# Altium project Faydali_Yuk_Project.PrjPcb
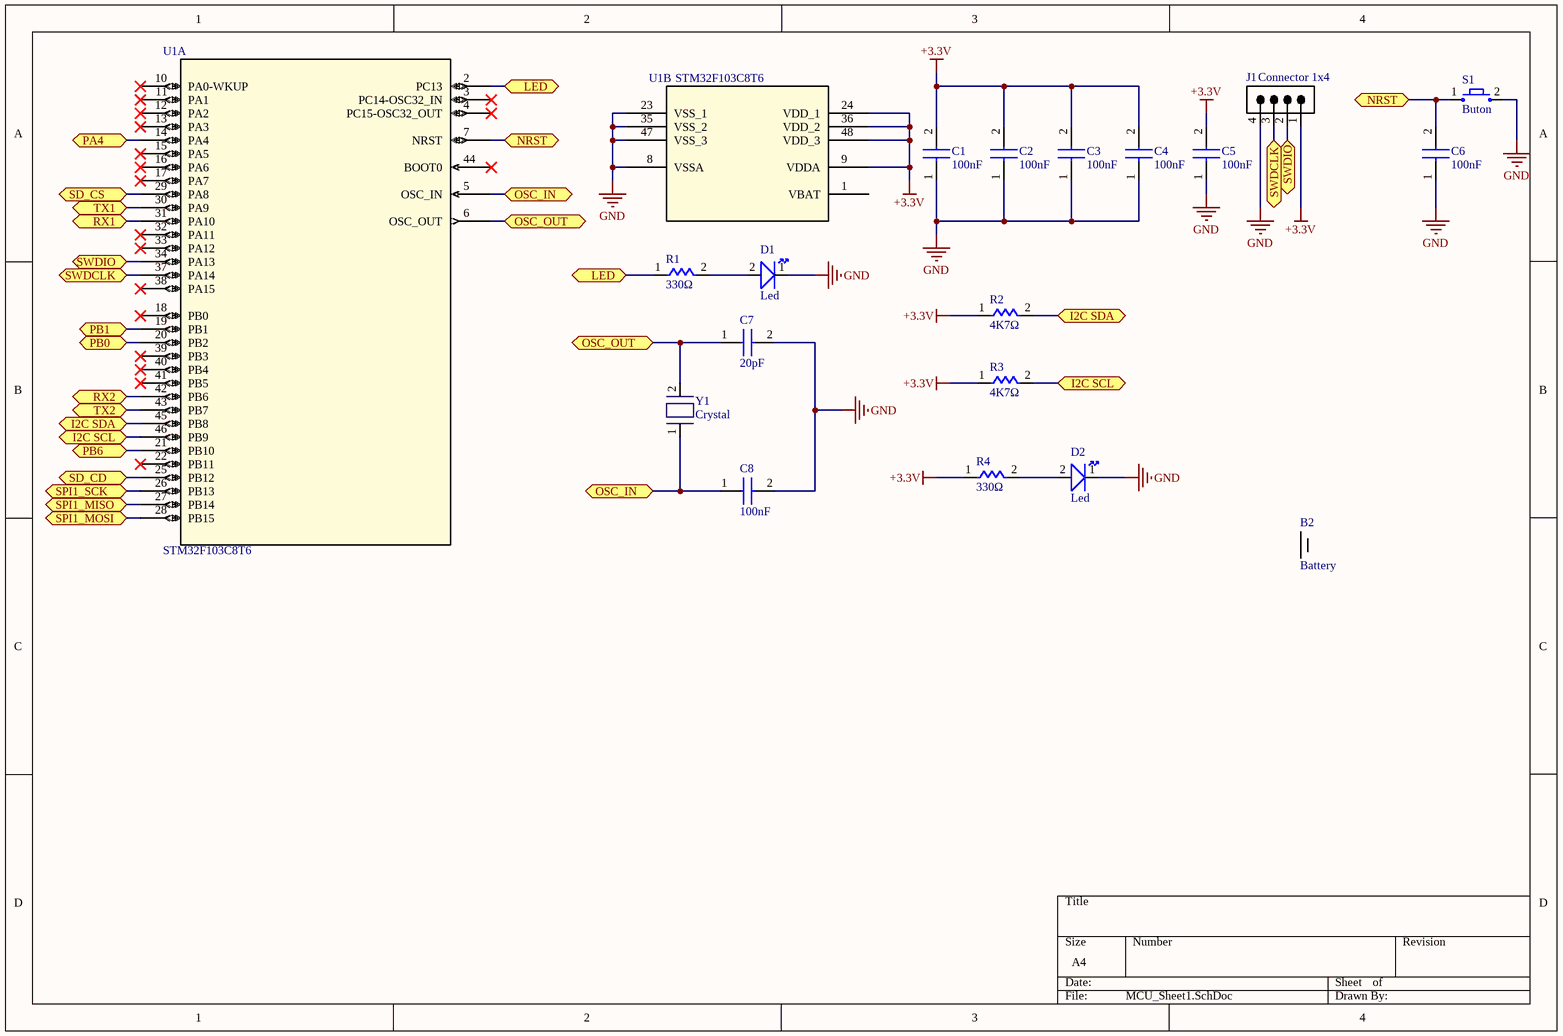
[diagram p0: MCU_Sheet1.SchDoc]
11 sheets, 73 parts. Net scope: flat (ports and power ports of the same name join across sheets).
Board file: PCB2.PcbDoc
Sheets:
  MCU_Sheet1.SchDoc
  SD_CARD_Sheet1.SchDoc
  BME_280_Sheet1.SchDoc
  MPU_6050_Sheet1.SchDoc
  LORA_Sheet1.SchDoc
  GY_NEO6MV2_Sheet1.SchDoc
  AMS_Sheet1.SchDoc
  LM2596_Sheet1.SchDoc
  OPEN_DRAIN_Sheet1.SchDoc
  Buzzer.SchDoc
  MQ-135.SchDoc

## Sheet MCU_Sheet1.SchDoc
size A4; SheetNumber: 1; SheetTotal: 11

### Parts
B2  Battery  [Lityum Battery]
C1  100nF  [CAP - 0603]
C2  100nF  [CAP - 0603]
C3  100nF  [CAP - 0603]
C4  100nF  [CAP - 0603]
C5  100nF  [CAP - 0603]
C6  100nF  [CAP - 0603]
C7  20pF  [CAP - 0603]
C8  100nF  [CAP - 0603]
D1  Led  [LED - 0603]
D2  Led  [LED - 0603]
J1  Connector 1x4  [Connector 1x4]
R1  330Ω  [RES - 0603]
R2  4K7Ω  [RES - 0603]
R3  4K7Ω  [RES - 0603]
R4  330Ω  [RES - 0603]
S1  Buton  [Button - DTSMF31RVTR]
U1  STM32F103C8T6  [LQFP48]  (parts A,B of 2)
Y1  Crystal  [Crystal - HC-49S SMD]

### Ports
I2C SCL (bidir), I2C SDA (bidir), LED (bidir), NRST (bidir), OSC_IN (bidir), OSC_OUT (bidir), PA4 (bidir), PB0 (bidir), PB1 (bidir), PB6 (bidir), RX1 (bidir), RX2 (bidir), SD_CD (bidir), SD_CS (bidir), SPI1_MISO (bidir), SPI1_MOSI (bidir), SPI1_SCK (bidir), SWDCLK (bidir), SWDIO (bidir), TX1 (bidir), TX2 (bidir)

### Nets
+3.3V: C1.2 C2.2 C3.2 C4.2 C5.2 J1.1 R2.1 R3.1 R4.1 U1.9(VDDA) U1.24(VDD_1) U1.36(VDD_2) U1.48(VDD_3)
GND: C1.1 C2.1 C3.1 C4.1 C5.1 C6.1 C7.2 C8.2 D1.1 D2.1 J1.4 S1.2 U1.8(VSSA) U1.23(VSS_1) U1.35(VSS_2) U1.47(VSS_3)
NetC6_2: C6.2 S1.1 U1.7(NRST) ; port NRST
NetC7_1: C7.1 U1.6(OSC_OUT) Y1.2 ; port OSC_OUT
NetC8_1: C8.1 U1.5(OSC_IN) Y1.1 ; port OSC_IN
NetD1_2: D1.2 R1.2
NetD2_2: D2.2 R4.2
NetJ1_2: J1.2 U1.34(PA13) ; port SWDIO
NetJ1_3: J1.3 U1.37(PA14) ; port SWDCLK
NetJ2_2: U1.29(PA8) ; port SD_CS
NetJ2_3: U1.28(PB15) ; port SPI1_MOSI
NetJ2_5: U1.26(PB13) ; port SPI1_SCK
NetJ2_7: U1.27(PB14) ; port SPI1_MISO
NetJ2_9: U1.25(PB12) ; port SD_CD
NetL2_3: U1.21(PB10) ; port PB6
NetR1_1: R1.1 U1.2(PC13) ; port LED
NetR2_2: R2.2 U1.45(PB8) ; port I2C SDA
NetR3_2: R3.2 U1.46(PB9) ; port I2C SCL
NetR10_1: U1.19(PB1) ; port PB1
NetR11_1: U1.20(PB2) ; port PB0
NetR15_1: U1.14(PA4) ; port PA4
NetR19_2: U1.42(PB6) ; port RX2
NetR20_2: U1.43(PB7) ; port TX2
NetU1_30: U1.30(PA9) ; port TX1
NetU1_31: U1.31(PA10) ; port RX1

Not connected (* = marked no-connect by the designer): U1 1(VBAT) 3(PC14-OSC32_IN)* 4(PC15-OSC32_OUT)* 10(PA0-WKUP)* 11(PA1)* 12(PA2)* 13(PA3)* 15(PA5)* 16(PA6)* 17(PA7)* 18(PB0)* 22(PB11)* 32(PA11)* 33(PA12)* 38(PA15)* 39(PB3)* 40(PB4)* 41(PB5)* 44(BOOT0)*

### Library data of the parts
C1-C8 = CAP: Capacitor; ComponentLink1Description: Satın Alma Linki; ComponentLink1URL: https://ozdisan.com/pasif-komponentler/kondansatorler/smt-smd-ve-mlcc-kondansatorler/CL10B472KB8NNNC; ComponentLink2Description: Satın Alma Linki; ComponentLink2URL: https://ozdisan.com/pasif-komponentler/kondansatorler/smt-smd-ve-mlcc-kondansatorler/CL10C200JB8NNNC; ComponentLink3Description: Satın Alma Linki; ComponentLink3URL: https://ozdisan.com/pasif-komponentler/kondansatorler/smt-smd-ve-mlcc-kondansatorler/CL10B104KB8NNNC; ComponentLink4Description: Datasheet; ComponentLink4URL: https://cdn.ozdisan.com/ETicaret_Dosya/448212_5798276.PDF; ComponentLink5Description: Satın Alma Linki; ComponentLink5URL: https://ozdisan.com/pasif-komponentler/kondansatorler/smt-smd-ve-mlcc-kondansatorler/CL10C101JB8NNNC
D1 D2 = Led: HL-PST-1608U51GC - LED SMD 0603 GREEN 500mcd 120° WATER CLEAR; ComponentLink1Description: Satın Alma Linki; ComponentLink1URL: https://ozdisan.com/Product/Detail/471660/HL-PST-1608U51GC; ComponentLink2Description: Datasheet; ComponentLink2URL: https://cdn.ozdisan.com/ETicaret_Dosya/471660_7204356.pdf
J1 = Connector 1x4: MOLEX-705530003 - CONNECTOR HEADER 2.54MM 4P 90C GOLD; ComponentLink1Description: Datasheet; ComponentLink1URL: https://www.molex.com/pdm_docs/sd/705530003_sd.pdf; ComponentLink2Description: Satın Alma Linki; ComponentLink2URL: https://www.ozdisan.com/konnektor-ve-baglanti-elemanlari/konnektor-cesitleri/pcb-konnektorler/MOLEX-705530003
R1-R4 = Res: SMD Res; ComponentLink1Description: Datasheet; ComponentLink1URL: https://cdn.ozdisan.com/ETicaret_Dosya/570122_9878629.pdf; ComponentLink2Description: Satın Alma Linki; ComponentLink2URL: https://www.ozdisan.com/pasif-komponentler/direncler/smt-smd-direncler/TC0325B3301T5C; ComponentLink3Description: Satın Alma Linki; ComponentLink3URL: https://ozdisan.com/pasif-komponentler/direncler/smt-smd-ve-cip-direncler/0603SAF4701T5E; ComponentLink4Description: Satın Alma Linki; ComponentLink4URL: https://ozdisan.com/pasif-komponentler/direncler/smt-smd-ve-cip-direncler/0805S8F604JT5E; ComponentLink5Description: Satın Alma Linki; ComponentLink5URL: https://ozdisan.com/pasif-komponentler/direncler/smt-smd-ve-cip-direncler/0603SAF1022T5E; ComponentLink6Description: Satın Alma Linki; ComponentLink6URL: https://www.ozdisan.com/pasif-komponentler/direncler/smt-smd-direncler/CQ03SAF0000T5E
S1 = Buton: DTSMF-31R-V-T/R - SWITCH TACT 6.00x3.50 4.30mm 260gF SMT V/T; ComponentLink1Description: Satın Alma Linki; ComponentLink1URL: https://ozdisan.com/Product/Detail/354235/DTSMF-31R-V-TR; ComponentLink2Description: Datasheet; ComponentLink2URL: https://cdn.ozdisan.com/ETicaret_Dosya/485632_396522.pdf
U1 = STM32F103C8T6: Microcontroller; Mfr_Name: STMicroelectronics; Copyright: Copyright (C) 2021 Ultra Librarian. All rights reserved.; Manufacturer_Part_Number: STM32F103C8T6; RefDes: RefDes; Type: DEV
Y1 = Crystal: AS-8.000-18-SMD-TR - CRYSTAL 8.0000MHZ 18PF SMD; ComponentLink1Description: Satın Alma Linki; ComponentLink1URL: https://ozdisan.com/pasif-komponentler/kristaller-osilatorler-ve-rezanatorler/kristaller/AS-8-000-18-SMD-TR; ComponentLink2Description: Datasheet; ComponentLink2URL: https://cdn.ozdisan.com/ETicaret_Dosya/40505_2732396.pdf
B2 = Battery: ComponentLink1Description: Satın Alma Linki; ComponentLink1URL: https://www.gittigidiyor.com/bilgisayar-tablet/12v-2-6a-lityum-batarya_pdp_728518934

## Sheet SD_CARD_Sheet1.SchDoc
size A4; SheetNumber: 2; SheetTotal: 11
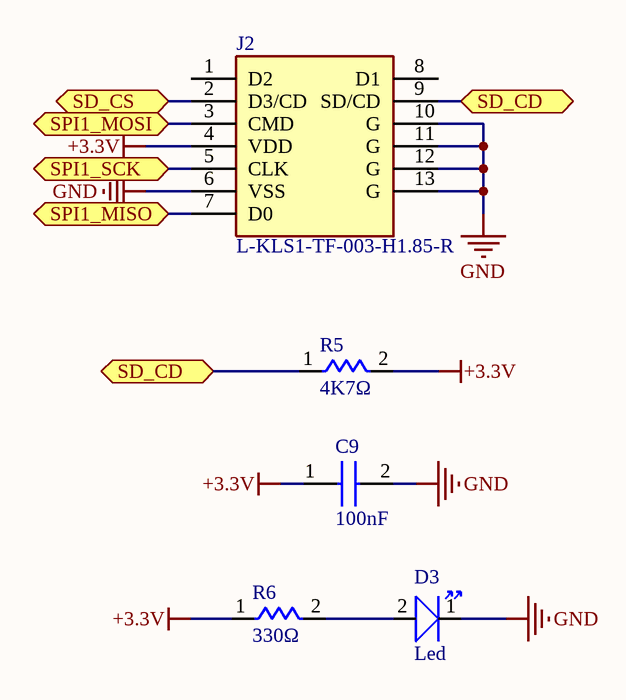
[diagram p1: SD_CARD_Sheet1.SchDoc]

### Parts
C9  100nF  [CAP - 0603]
D3  Led  [LED - 0603]
J2  L-KLS1-TF-003-H1.85-R  [SD CARD L-KLS1-TF-003-H1.85-R]
R5  4K7Ω  [RES - 0603]
R6  330Ω  [RES - 0603]

### Ports
SD_CD (bidir), SD_CS (bidir), SPI1_MISO (bidir), SPI1_MOSI (bidir), SPI1_SCK (bidir)

### Nets
+3.3V: C9.1 J2.4(VDD) R5.2 R6.1
GND: C9.2 D3.1 J2.6(VSS) J2.10(G) J2.11(G) J2.12(G) J2.13(G)
NetD3_2: D3.2 R6.2
NetJ2_2: J2.2(D3/CD) ; port SD_CS
NetJ2_3: J2.3(CMD) ; port SPI1_MOSI
NetJ2_5: J2.5(CLK) ; port SPI1_SCK
NetJ2_7: J2.7(D0) ; port SPI1_MISO
NetJ2_9: J2.9(SD/CD) R5.1 ; port SD_CD

Not connected (* = marked no-connect by the designer): J2 1(D2) 8(D1)

### Library data of the parts
C9 = CAP: Capacitor; ComponentLink1Description: Satın Alma Linki; ComponentLink1URL: https://ozdisan.com/pasif-komponentler/kondansatorler/smt-smd-ve-mlcc-kondansatorler/CL10B472KB8NNNC; ComponentLink2Description: Satın Alma Linki; ComponentLink2URL: https://ozdisan.com/pasif-komponentler/kondansatorler/smt-smd-ve-mlcc-kondansatorler/CL10C200JB8NNNC; ComponentLink3Description: Satın Alma Linki; ComponentLink3URL: https://ozdisan.com/pasif-komponentler/kondansatorler/smt-smd-ve-mlcc-kondansatorler/CL10B104KB8NNNC; ComponentLink4Description: Datasheet; ComponentLink4URL: https://cdn.ozdisan.com/ETicaret_Dosya/448212_5798276.PDF; ComponentLink5Description: Satın Alma Linki; ComponentLink5URL: https://ozdisan.com/pasif-komponentler/kondansatorler/smt-smd-ve-mlcc-kondansatorler/CL10C101JB8NNNC
D3 = Led: as D1 on sheet MCU_Sheet1; ComponentLink1Description: Satın Alma Linki; ComponentLink1URL: https://ozdisan.com/Product/Detail/471660/HL-PST-1608U51GC; ComponentLink2Description: Datasheet; ComponentLink2URL: https://cdn.ozdisan.com/ETicaret_Dosya/471660_7204356.pdf
J2 = SD CARD L-KLS1-TF-003-H1.85-R: L-KLS1-TF-003-H1.85-R - CONNECTOR MICRO SD CARD SMD KLS; Manufacturer_Name: KLS Electronic; Datasheet Link: https://img.ozdisan.com/ETicaret_Dosya/476392_7149645.pdf; Manufacturer_Part_Number: L-KLS1-TF-003-H1.85-R; ComponentLink1Description: Satın Alma Linki; ComponentLink1URL: https://ozdisan.com/Product/Detail/466548/L-KLS1-TF-003-H1-85-R; ComponentLink2Description: Datasheet; ComponentLink2URL: https://cdn.ozdisan.com/ETicaret_Dosya/466548_2616024.PDF
R5 R6 = Res: SMD Res; ComponentLink1Description: Datasheet; ComponentLink1URL: https://cdn.ozdisan.com/ETicaret_Dosya/570122_9878629.pdf; ComponentLink2Description: Satın Alma Linki; ComponentLink2URL: https://www.ozdisan.com/pasif-komponentler/direncler/smt-smd-direncler/TC0325B3301T5C; ComponentLink3Description: Satın Alma Linki; ComponentLink3URL: https://ozdisan.com/pasif-komponentler/direncler/smt-smd-ve-cip-direncler/0603SAF4701T5E; ComponentLink4Description: Satın Alma Linki; ComponentLink4URL: https://ozdisan.com/pasif-komponentler/direncler/smt-smd-ve-cip-direncler/0805S8F604JT5E; ComponentLink5Description: Satın Alma Linki; ComponentLink5URL: https://ozdisan.com/pasif-komponentler/direncler/smt-smd-ve-cip-direncler/0603SAF1022T5E; ComponentLink6Description: Satın Alma Linki; ComponentLink6URL: https://www.ozdisan.com/pasif-komponentler/direncler/smt-smd-direncler/CQ03SAF0000T5E

## Sheet BME_280_Sheet1.SchDoc
size A4; SheetNumber: 3; SheetTotal: 11
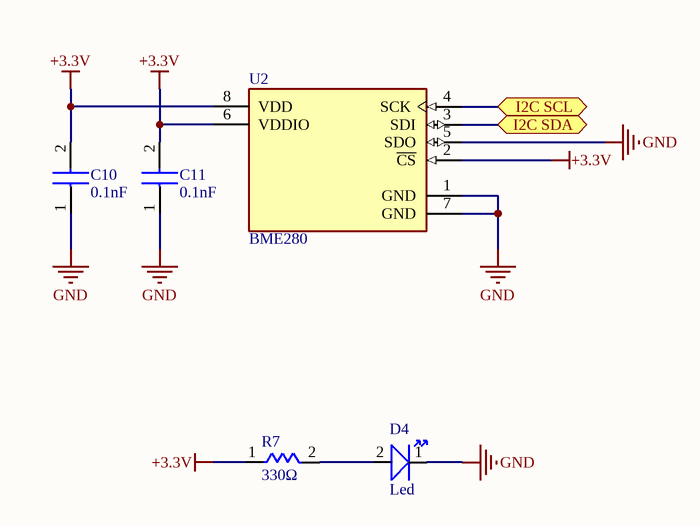
[diagram p2: BME_280_Sheet1.SchDoc]

### Parts
C10  0.1nF  [CAP - 0603]
C11  0.1nF  [CAP - 0603]
D4  Led  [LED - 0603]
R7  330Ω  [RES - 0603]
U2  BME280  [BME280 - FP-BME280-MFG]

### Ports
I2C SCL (bidir), I2C SDA (bidir)

### Nets
+3.3V: C10.2 C11.2 R7.1 U2.2(~{CS}) U2.6(VDDIO) U2.8(VDD)
GND: C10.1 C11.1 D4.1 U2.1(GND) U2.5(SDO) U2.7(GND)
NetD4_2: D4.2 R7.2
NetR2_2: U2.3(SDI) ; port I2C SDA
NetR3_2: U2.4(SCK) ; port I2C SCL

### Library data of the parts
C10 C11 = CAP: Capacitor; ComponentLink1Description: Satın Alma Linki; ComponentLink1URL: https://ozdisan.com/pasif-komponentler/kondansatorler/smt-smd-ve-mlcc-kondansatorler/CL10B472KB8NNNC; ComponentLink2Description: Satın Alma Linki; ComponentLink2URL: https://ozdisan.com/pasif-komponentler/kondansatorler/smt-smd-ve-mlcc-kondansatorler/CL10C200JB8NNNC; ComponentLink3Description: Satın Alma Linki; ComponentLink3URL: https://ozdisan.com/pasif-komponentler/kondansatorler/smt-smd-ve-mlcc-kondansatorler/CL10B104KB8NNNC; ComponentLink4Description: Datasheet; ComponentLink4URL: https://cdn.ozdisan.com/ETicaret_Dosya/448212_5798276.PDF; ComponentLink5Description: Satın Alma Linki; ComponentLink5URL: https://ozdisan.com/pasif-komponentler/kondansatorler/smt-smd-ve-mlcc-kondansatorler/CL10C101JB8NNNC
D4 = Led: as D1 on sheet MCU_Sheet1; ComponentLink1Description: Satın Alma Linki; ComponentLink1URL: https://ozdisan.com/Product/Detail/471660/HL-PST-1608U51GC; ComponentLink2Description: Datasheet; ComponentLink2URL: https://cdn.ozdisan.com/ETicaret_Dosya/471660_7204356.pdf
R7 = Res: SMD Res; ComponentLink1Description: Datasheet; ComponentLink1URL: https://cdn.ozdisan.com/ETicaret_Dosya/570122_9878629.pdf; ComponentLink2Description: Satın Alma Linki; ComponentLink2URL: https://www.ozdisan.com/pasif-komponentler/direncler/smt-smd-direncler/TC0325B3301T5C; ComponentLink3Description: Satın Alma Linki; ComponentLink3URL: https://ozdisan.com/pasif-komponentler/direncler/smt-smd-ve-cip-direncler/0603SAF4701T5E; ComponentLink4Description: Satın Alma Linki; ComponentLink4URL: https://ozdisan.com/pasif-komponentler/direncler/smt-smd-ve-cip-direncler/0805S8F604JT5E; ComponentLink5Description: Satın Alma Linki; ComponentLink5URL: https://ozdisan.com/pasif-komponentler/direncler/smt-smd-ve-cip-direncler/0603SAF1022T5E; ComponentLink6Description: Satın Alma Linki; ComponentLink6URL: https://www.ozdisan.com/pasif-komponentler/direncler/smt-smd-direncler/CQ03SAF0000T5E
U2 = BME 280- CMP-2000-05073-3: SENSOR PRESSURE HUMIDITY TEMP; Sensor Type: Temperature; Accuracy: 3%; Response Time: 1s; Output Type: SPI; Min Operating Temperature: -40°C; Max Operating Temperature: 85°C; Case/Package: LGA; Packaging: Cut Tape; Mount: Surface Mount; Lead Free: Lead Free; Number of Pins: 8; ComponentLink1Description: Satın Alma Linki; ComponentLink1URL: https://ozdisan.com/optolar-ve-sensorler/sensorler/nem-sensorleri/BME280; ComponentLink2Description: Datasheet; ComponentLink2URL: https://cdn.ozdisan.com/ETicaret_Dosya/611017_160241.pdf

## Sheet MPU_6050_Sheet1.SchDoc
size A4; SheetNumber: 4; SheetTotal: 11
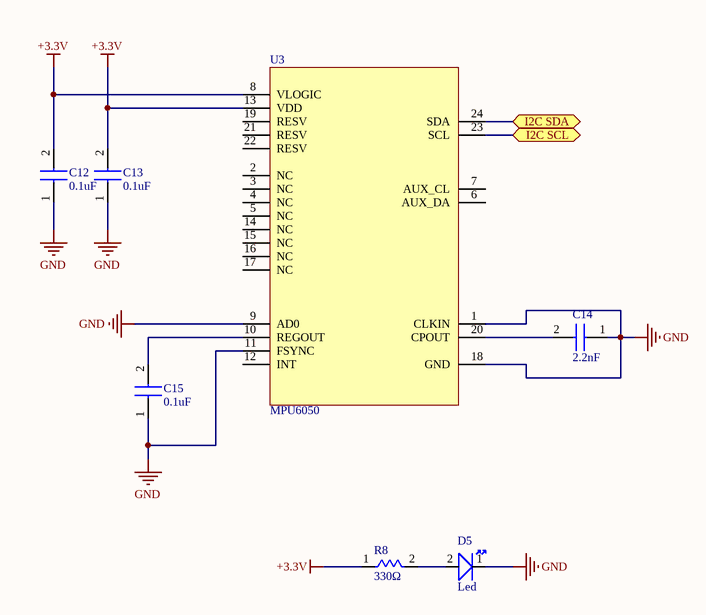
[diagram p3: MPU_6050_Sheet1.SchDoc]

### Parts
C12  0.1uF  [CAP - 0603]
C13  0.1uF  [CAP - 0603]
C14  2.2nF  [CAP - 0603]
C15  0.1uF  [CAP - 0603]
D5  Led  [LED - 0603]
R8  330Ω  [RES - 0603]
U3  MPU6050  [QFN50P400X400X90_HS-25N - duplicate]

### Ports
I2C SCL (bidir), I2C SDA (bidir)

### Nets
+3.3V: C12.2 C13.2 R8.1 U3.8(VLOGIC) U3.13(VDD)
GND: C12.1 C13.1 C14.1 C15.1 D5.1 U3.1(CLKIN) U3.9(AD0) U3.11(FSYNC) U3.18(GND)
NetC14_2: C14.2 U3.20(CPOUT)
NetC15_2: C15.2 U3.10(REGOUT)
NetD5_2: D5.2 R8.2
NetR2_2: U3.24(SDA) ; port I2C SDA
NetR3_2: U3.23(SCL) ; port I2C SCL

Not connected (* = marked no-connect by the designer): U3 2(NC) 3(NC) 4(NC) 5(NC) 6(AUX_DA) 7(AUX_CL) 12(INT) 14(NC) 15(NC) 16(NC) 17(NC) 19(RESV) 21(RESV) 22(RESV)

### Library data of the parts
C12-C15 = CAP: Capacitor; ComponentLink1Description: Satın Alma Linki; ComponentLink1URL: https://ozdisan.com/pasif-komponentler/kondansatorler/smt-smd-ve-mlcc-kondansatorler/CL10B472KB8NNNC; ComponentLink2Description: Satın Alma Linki; ComponentLink2URL: https://ozdisan.com/pasif-komponentler/kondansatorler/smt-smd-ve-mlcc-kondansatorler/CL10C200JB8NNNC; ComponentLink3Description: Satın Alma Linki; ComponentLink3URL: https://ozdisan.com/pasif-komponentler/kondansatorler/smt-smd-ve-mlcc-kondansatorler/CL10B104KB8NNNC; ComponentLink4Description: Datasheet; ComponentLink4URL: https://cdn.ozdisan.com/ETicaret_Dosya/448212_5798276.PDF; ComponentLink5Description: Satın Alma Linki; ComponentLink5URL: https://ozdisan.com/pasif-komponentler/kondansatorler/smt-smd-ve-mlcc-kondansatorler/CL10C101JB8NNNC
D5 = Led: as D1 on sheet MCU_Sheet1; ComponentLink1Description: Satın Alma Linki; ComponentLink1URL: https://ozdisan.com/Product/Detail/471660/HL-PST-1608U51GC; ComponentLink2Description: Datasheet; ComponentLink2URL: https://cdn.ozdisan.com/ETicaret_Dosya/471660_7204356.pdf
R8 = Res: SMD Res; ComponentLink1Description: Datasheet; ComponentLink1URL: https://cdn.ozdisan.com/ETicaret_Dosya/570122_9878629.pdf; ComponentLink2Description: Satın Alma Linki; ComponentLink2URL: https://www.ozdisan.com/pasif-komponentler/direncler/smt-smd-direncler/TC0325B3301T5C; ComponentLink3Description: Satın Alma Linki; ComponentLink3URL: https://ozdisan.com/pasif-komponentler/direncler/smt-smd-ve-cip-direncler/0603SAF4701T5E; ComponentLink4Description: Satın Alma Linki; ComponentLink4URL: https://ozdisan.com/pasif-komponentler/direncler/smt-smd-ve-cip-direncler/0805S8F604JT5E; ComponentLink5Description: Satın Alma Linki; ComponentLink5URL: https://ozdisan.com/pasif-komponentler/direncler/smt-smd-ve-cip-direncler/0603SAF1022T5E; ComponentLink6Description: Satın Alma Linki; ComponentLink6URL: https://www.ozdisan.com/pasif-komponentler/direncler/smt-smd-direncler/CQ03SAF0000T5E
U3 = MPU6050: MPU6050 GYRO; ComponentLink1Description: Satın Alma Linki; ComponentLink1URL: https://tr.aliexpress.com/item/1005001724323744.html?gatewayAdapt=glo2tur&_randl_currency=TRY&_randl_shipto=TR&src=google&aff_fcid=dbdd7f5563804875a046a33b7e55afff-1643366594388-08611-UneMJZVf&aff_fsk=UneMJZVf&aff_platform=aaf&sk=UneMJZVf&aff_trace_key=dbdd7f5563804875a046a33b7e55afff-1643366594388-08611-UneMJZVf&terminal_id=cd33f9e12bf84a9c9c6bb26df30b5329; ComponentLink2Description: Datasheet; ComponentLink2URL: https://invensense.tdk.com/wp-content/uploads/2015/02/MPU-6000-Datasheet1.pdf

## Sheet LORA_Sheet1.SchDoc
size A4; SheetNumber: 5; SheetTotal: 11
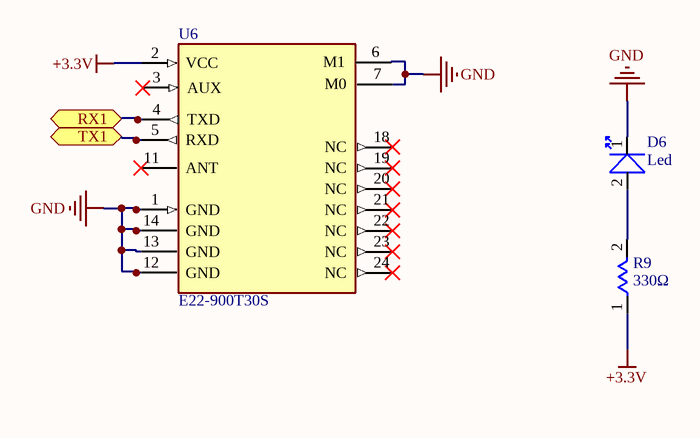
[diagram p4: LORA_Sheet1.SchDoc]

### Parts
D6  Led  [LED - 0603]
R9  330Ω  [RES - 0603]
U6  E22-900T30S  [E220-400T30S]

### Ports
RX1 (bidir), TX1 (bidir)

### Nets
+3.3V: R9.1 U6.2(VCC)
GND: D6.1 U6.1(GND) U6.6(M1) U6.7(M0) U6.12(GND) U6.13(GND) U6.14(GND)
NetD6_2: D6.2 R9.2
NetU1_30: U6.5(RXD) ; port TX1
NetU1_31: U6.4(TXD) ; port RX1

Not connected (* = marked no-connect by the designer): U6 3(AUX)* 11(ANT)* 18(NC)* 19(NC)* 20(NC)* 21(NC)* 22(NC)* 23(NC)* 24(NC)*

### Library data of the parts
D6 = Led: as D1 on sheet MCU_Sheet1; ComponentLink1Description: Satın Alma Linki; ComponentLink1URL: https://ozdisan.com/Product/Detail/471660/HL-PST-1608U51GC; ComponentLink2Description: Datasheet; ComponentLink2URL: https://cdn.ozdisan.com/ETicaret_Dosya/471660_7204356.pdf
R9 = Res: SMD Res; ComponentLink1Description: Datasheet; ComponentLink1URL: https://cdn.ozdisan.com/ETicaret_Dosya/570122_9878629.pdf; ComponentLink2Description: Satın Alma Linki; ComponentLink2URL: https://www.ozdisan.com/pasif-komponentler/direncler/smt-smd-direncler/TC0325B3301T5C; ComponentLink3Description: Satın Alma Linki; ComponentLink3URL: https://ozdisan.com/pasif-komponentler/direncler/smt-smd-ve-cip-direncler/0603SAF4701T5E; ComponentLink4Description: Satın Alma Linki; ComponentLink4URL: https://ozdisan.com/pasif-komponentler/direncler/smt-smd-ve-cip-direncler/0805S8F604JT5E; ComponentLink5Description: Satın Alma Linki; ComponentLink5URL: https://ozdisan.com/pasif-komponentler/direncler/smt-smd-ve-cip-direncler/0603SAF1022T5E; ComponentLink6Description: Satın Alma Linki; ComponentLink6URL: https://www.ozdisan.com/pasif-komponentler/direncler/smt-smd-direncler/CQ03SAF0000T5E
U6 = E22-900T30S: E22-900T30S is a wireless serial port module _UART_ based on SEMTECH's SX1262 RF chip.; MF: EBYTE; MP: E22-900T30S; Package: Package Analog Devices; Price: None; Value: *; SnapEDA_Link: https://www.snapeda.com/parts/E22-900T30S/EBYTE/view-part/3611926/?ref=snap; Availability: Unavailable; ComponentLink1Description: Satın Alma L,nk,; ComponentLink1URL: https://www.f1depo.com/urun/ebyte-e220-400t30s-433-mhz-30dbm-lora-modul-10km; ComponentLink2Description: Datasheet; ComponentLink2URL: https://www.google.com/search?q=EBYTE+E220-400T30S+433+Mhz+30dbm+Lora+Mod%C3%BCl+datasheet&oq=EBYTE+E220-400T30S+433+Mhz+30dbm+Lora+Mod%C3%BCl+datasheet&aqs=chrome..69i57j33i10i21.2976j0j7&sourceid=chrome&ie=UTF-8

## Sheet GY_NEO6MV2_Sheet1.SchDoc
size A4; SheetNumber: 6; SheetTotal: 11
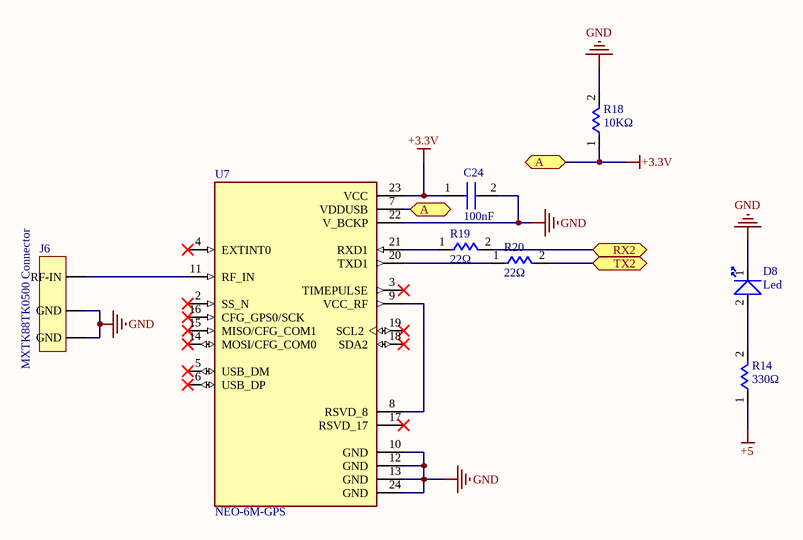
[diagram p5: GY_NEO6MV2_Sheet1.SchDoc]

### Parts
C24  100nF  [CAP - 0603]
D8  Led  [LED - 0603]
J6  MXTK88TK0500 Connector  [MXTK88TK0500 Connector]
R14  330Ω  [RES - 0603]
R18  10KΩ  [RES - 0603]
R19  22Ω  [RES - 0603]
R20  22Ω  [RES - 0603]
U7  NEO-6M-GPS  [XCVR_NEO-6M-GPS]

### Ports
A (bidir), RX2 (bidir), TX2 (bidir)

### Nets
+3.3V: C24.1 R18.1 U7.7(VDDUSB) U7.23(VCC) ; port A
+5: R14.1
GND: C24.2 D8.1 J6.1(GND) J6.2(GND) R18.2 U7.10(GND) U7.12(GND) U7.13(GND) U7.22(V_BCKP) U7.24(GND)
NetD8_2: D8.2 R14.2
NetJ6_3: J6.3(RF-IN) U7.11(RF_IN)
NetR19_1: R19.1 U7.21(RXD1)
NetR19_2: R19.2 ; port RX2
NetR20_1: R20.1 U7.20(TXD1)
NetR20_2: R20.2 ; port TX2
NetU7_8: U7.8(RSVD_8) U7.9(VCC_RF)

Not connected (* = marked no-connect by the designer): U7 2(SS_N)* 3(TIMEPULSE)* 4(EXTINT0)* 5(USB_DM)* 6(USB_DP)* 14(MOSI/CFG_COM0)* 15(MISO/CFG_COM1)* 16(CFG_GPS0/SCK)* 17(RSVD_17)* 18(SDA2)* 19(SCL2)*

### Library data of the parts
C24 = CAP: Capacitor; ComponentLink1Description: Satın Alma Linki; ComponentLink1URL: https://ozdisan.com/pasif-komponentler/kondansatorler/smt-smd-ve-mlcc-kondansatorler/CL10B472KB8NNNC; ComponentLink2Description: Satın Alma Linki; ComponentLink2URL: https://ozdisan.com/pasif-komponentler/kondansatorler/smt-smd-ve-mlcc-kondansatorler/CL10C200JB8NNNC; ComponentLink3Description: Satın Alma Linki; ComponentLink3URL: https://ozdisan.com/pasif-komponentler/kondansatorler/smt-smd-ve-mlcc-kondansatorler/CL10B104KB8NNNC; ComponentLink4Description: Datasheet; ComponentLink4URL: https://cdn.ozdisan.com/ETicaret_Dosya/448212_5798276.PDF; ComponentLink5Description: Satın Alma Linki; ComponentLink5URL: https://ozdisan.com/pasif-komponentler/kondansatorler/smt-smd-ve-mlcc-kondansatorler/CL10C101JB8NNNC
D8 = Led: as D1 on sheet MCU_Sheet1; ComponentLink1Description: Satın Alma Linki; ComponentLink1URL: https://ozdisan.com/Product/Detail/471660/HL-PST-1608U51GC; ComponentLink2Description: Datasheet; ComponentLink2URL: https://cdn.ozdisan.com/ETicaret_Dosya/471660_7204356.pdf
J6 = MXTK88TK0500 Connector: CABLE ASSEMBLY COAXIAL 0.5m GSC CONN.PL-PL; ComponentLink1Description: Datashet; ComponentLink1URL: https://www.robo90.com/ufl-rf-konnektor-smd-ipex-pcb-konnektor?gclid=Cj0KCQiAjJOQBhCkARIsAEKMtO3EQQtFxcQxxYyV63gND7p49a9U-0KiGjZnTbRHjlZa4_YkA7jEr6QaAmQAEALw_wcB; ComponentLink2Description: Satın Alma Linki; ComponentLink2URL: https://ozdisan.com/konnektor-ve-baglanti-elemanlari/koaksiyel-konnektorler/koaksiyel-kablo-birlestiricileri/MXTK88TK0500
R14 R18-R20 = Res: SMD Res; ComponentLink1Description: Datasheet; ComponentLink1URL: https://cdn.ozdisan.com/ETicaret_Dosya/570122_9878629.pdf; ComponentLink2Description: Satın Alma Linki; ComponentLink2URL: https://www.ozdisan.com/pasif-komponentler/direncler/smt-smd-direncler/TC0325B3301T5C; ComponentLink3Description: Satın Alma Linki; ComponentLink3URL: https://ozdisan.com/pasif-komponentler/direncler/smt-smd-ve-cip-direncler/0603SAF4701T5E; ComponentLink4Description: Satın Alma Linki; ComponentLink4URL: https://ozdisan.com/pasif-komponentler/direncler/smt-smd-ve-cip-direncler/0805S8F604JT5E; ComponentLink5Description: Satın Alma Linki; ComponentLink5URL: https://ozdisan.com/pasif-komponentler/direncler/smt-smd-ve-cip-direncler/0603SAF1022T5E; ComponentLink6Description: Satın Alma Linki; ComponentLink6URL: https://www.ozdisan.com/pasif-komponentler/direncler/smt-smd-direncler/CQ03SAF0000T5E
U7 = NEO-6M-GPS: SMD GPS Module;; MF: u-blox; Availability: Unavailable; MP: NEO-6M-GPS; Package: None; SnapEDA_Link: https://www.snapeda.com/parts/NEO-6M-GPS/u-blox/view-part/105879/?ref=snap; Value: *; Price: None; ComponentLink1Description: Datasheet; ComponentLink1URL: https://cdn.ozdisan.com/ETicaret_Dosya/634963_988117.PDF; ComponentLink2Description: Datasheet; ComponentLink2URL: https://www.u-blox.com/sites/default/files/products/documents/LEA-NEO-MAX-6_HIM_%28UBX-14054794%29.pdf?utm_source=en%2Fimages%2Fdownloads%2FProduct_Docs%2FLEA-6_NEO-6_MAX-6_HardwareIntegrationManual_%28GPS.G6-HW-09007%29.pdf#page=33&zoom=100,72,125; ComponentLink3Description: Satın Alma Linki; ComponentLink3URL: https://www.robo90.com/ufl-rf-konnektor-smd-ipex-pcb-konnektor?gclid=Cj0KCQiAjJOQBhCkARIsAEKMtO3EQQtFxcQxxYyV63gND7p49a9U-0KiGjZnTbRHjlZa4_YkA7jEr6QaAmQAEALw_wcB; ComponentLink4Description: Satın Alma Linki; ComponentLink4URL: https://www.robocombo.com/u-blox-NEO-6M-GPS-Modulu,PR-1278.html

## Sheet AMS_Sheet1.SchDoc
size A4; SheetNumber: 7; SheetTotal: 11
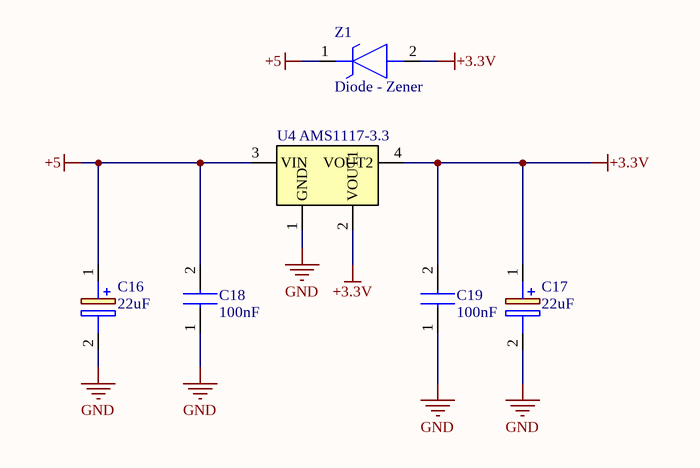
[diagram p6: AMS_Sheet1.SchDoc]

### Parts
C16  22uF  [CAPP_Lytic_D_6.6]
C17  22uF  [CAPP_Lytic_D_6.6]
C18  100nF  [CAP - 0603]
C19  100nF  [CAP - 0603]
U4  AMS1117-3.3  [SOT-223 - AMS1117-3.3]
Z1  Diode - Zener  [SOD-80 (MINIMELF)]

### Nets
+3.3V: C17.1(+) C19.2 U4.2(VOUT1) U4.4(VOUT2) Z1.2(A)
+5: C16.1(+) C18.2 U4.3(VIN) Z1.1(K)
GND: C16.2(-) C17.2(-) C18.1 C19.1 U4.1(GND)

### Library data of the parts
C16 C17 = Cap - Pol: Capacitor Polarised; ComponentLink1Description: Satın Alma Linki; ComponentLink1URL: https://ozdisan.com/pasif-komponentler/kondansatorler/aluminyum-kondansatorler/BDS35VC220MH10TP; ComponentLink2Description: Satın Alma Linki; ComponentLink2URL: https://ozdisan.com/pasif-komponentler/kondansatorler/aluminyum-kondansatorler/SC1H226M6L005VR; ComponentLink3Description: Satın Alma Linki; ComponentLink3URL: https://ozdisan.com/pasif-komponentler/kondansatorler/aluminyum-kondansatorler/BDA50VC10MF55TP; ComponentLink4Description: Datasheet; ComponentLink4URL: https://cdn.ozdisan.com/ETicaret_Dosya/455406_6857235.pdf
C18 C19 = CAP: Capacitor; ComponentLink1Description: Satın Alma Linki; ComponentLink1URL: https://ozdisan.com/pasif-komponentler/kondansatorler/smt-smd-ve-mlcc-kondansatorler/CL10B472KB8NNNC; ComponentLink2Description: Satın Alma Linki; ComponentLink2URL: https://ozdisan.com/pasif-komponentler/kondansatorler/smt-smd-ve-mlcc-kondansatorler/CL10C200JB8NNNC; ComponentLink3Description: Satın Alma Linki; ComponentLink3URL: https://ozdisan.com/pasif-komponentler/kondansatorler/smt-smd-ve-mlcc-kondansatorler/CL10B104KB8NNNC; ComponentLink4Description: Datasheet; ComponentLink4URL: https://cdn.ozdisan.com/ETicaret_Dosya/448212_5798276.PDF; ComponentLink5Description: Satın Alma Linki; ComponentLink5URL: https://ozdisan.com/pasif-komponentler/kondansatorler/smt-smd-ve-mlcc-kondansatorler/CL10C101JB8NNNC
U4 = AMS1117-3.3: Manufacturer_Name: Advanced Monolithic Systems; Datasheet Link: http://www.advanced-monolithic.com/pdf/ds1117.pdf; Height: 1.8mm; Manufacturer_Part_Number: AMS1117-3.3; ComponentLink1Description: Satın Alma Linki; ComponentLink1URL: https://ozdisan.com/entegre-devreler-ics/guc-entegreleri/lineer-voltaj-regulatorleri/AMS1117-3-3
Z1 = Diode - Zener: Zener Diode; ComponentLink1Description: Satın Alma Linki; ComponentLink1URL: https://www.ozdisan.com/guc-yari-iletkenleri/diyotlar-modul-diyotlar-ve-dogrultucular/zener-diyotlar/ZMM55C3V3-HT; ComponentLink2Description: Datasheet; ComponentLink2URL: https://cdn.ozdisan.com/ETicaret_Dosya/417232_6139407.pdf

## Sheet LM2596_Sheet1.SchDoc
size A4; SheetNumber: 8; SheetTotal: 11
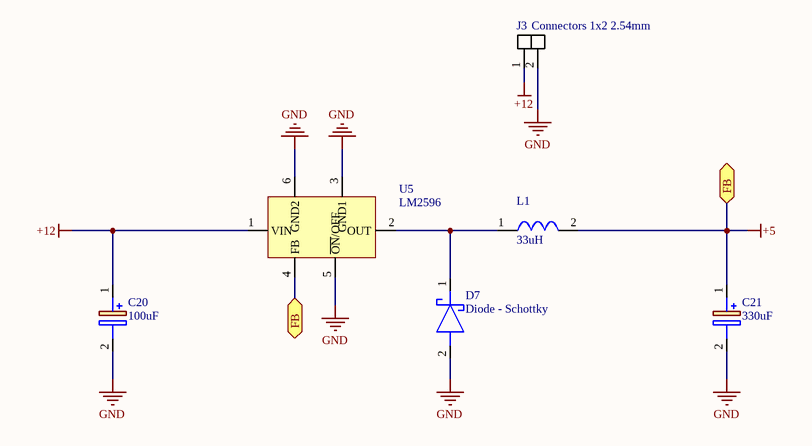
[diagram p7: LM2596_Sheet1.SchDoc]

### Parts
C20  100uF  [CAPP_Lytic_D_6.6]
C21  330uF  [CAPP_Lytic_D_6.6]
D7  Diode - Schottky  [DO214AB (SMC)]
J3  Connectors 1x2 2.54mm  [Connectors 1x2 2.54mm]
L1  33uH  [INDUCTOR  - 12X12 SMD]
U5  LM2596  [TO263-5 (D2PAK-5) - LM2596R-5.0-HTC]

### Ports
FB (bidir)

### Nets
+5: C21.1(+) L1.2 U5.4(FB) ; port FB
+12: C20.1(+) J3.1 U5.1(VIN)
GND: C20.2(-) C21.2(-) D7.2(A) J3.2 U5.3(GND1) U5.5(~{ON}/OFF) U5.6(GND2)
NetD7_1: D7.1(K) L1.1 U5.2(OUT)

### Library data of the parts
C20 C21 = Cap - Pol: Capacitor Polarised; ComponentLink1Description: Satın Alma Linki; ComponentLink1URL: https://ozdisan.com/pasif-komponentler/kondansatorler/aluminyum-kondansatorler/BDS35VC220MH10TP; ComponentLink2Description: Satın Alma Linki; ComponentLink2URL: https://ozdisan.com/pasif-komponentler/kondansatorler/aluminyum-kondansatorler/SC1H226M6L005VR; ComponentLink3Description: Satın Alma Linki; ComponentLink3URL: https://ozdisan.com/pasif-komponentler/kondansatorler/aluminyum-kondansatorler/BDA50VC10MF55TP; ComponentLink4Description: Datasheet; ComponentLink4URL: https://cdn.ozdisan.com/ETicaret_Dosya/455406_6857235.pdf
D7 = Diode - Schottky: Schottky Diode; ComponentLink1Description: Satın Alma Linki; ComponentLink1URL: https://ozdisan.com/guc-yari-iletkenleri/diyotlar-modul-diyotlar-ve-dogrultucular/schottky-diyotlar/SK56-HT; ComponentLink2Description: Datasheet; ComponentLink2URL: https://cdn.ozdisan.com/ETicaret_Dosya/475561_8333135.pdf
J3 = Connectors 1x2 2.54mm: 2 Pin (1x2) 2.54mm Erkek Pin Header THT; ComponentLink1Description: Satın Alma Linki; ComponentLink1URL: https://www.direnc.net/2-pin-1x2-254mm-erkek-pin-header-tht; ComponentLink2Description: Datasheet; ComponentLink2URL: https://pdf.direnc.net/upload/2-pin-1x2-254mm-erkek-pin-header-tht-datasheet.pdf
L1 = INDUCTOR 33uH: SRI1204-330M - INDUCTOR POWER 33UH 12X12X5MM SMD; ComponentLink1Description: Datasheet; ComponentLink1URL: https://cdn.ozdisan.com/ETicaret_Dosya/501799_1085379.pdf; ComponentLink2Description: Satın Alma Linki; ComponentLink2URL: https://ozdisan.com/pasif-komponentler/induktorler/sabit-induktorler/SRI1204-330M
U5 = LM2596: LM2596R-5.0-HTC - IC-2596 V.REG.3A 5V STEP-DOWN TO-263-5L; ComponentLink1Description: Datasheet; ComponentLink1URL: https://cdn.ozdisan.com/ETicaret_Dosya/587696_4979854.pdf; ComponentLink2Description: Satın Alma Linki; ComponentLink2URL: https://ozdisan.com/entegre-devreler-ics/guc-entegreleri/dc-dc-voltaj-regulatorleri/LM2596R-5-0-HTC

## Sheet OPEN_DRAIN_Sheet1.SchDoc
size A4; SheetNumber: 9; SheetTotal: 9
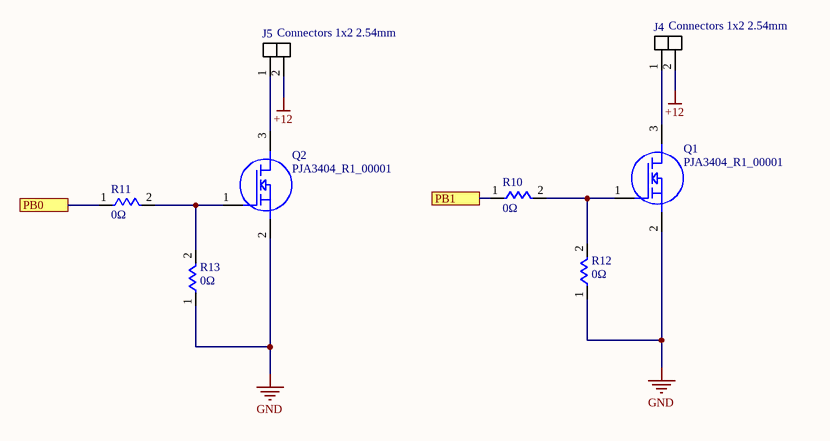
[diagram p8: OPEN_DRAIN_Sheet1.SchDoc]

### Parts
J4  Connectors 1x2 2.54mm  [Connectors 1x2 2.54mm]
J5  Connectors 1x2 2.54mm  [Connectors 1x2 2.54mm]
Q1  PJA3404_R1_00001  [SOT95P240X110-3N]
Q2  PJA3404_R1_00001  [SOT95P240X110-3N]
R10  0Ω  [RES - 0603]
R11  0Ω  [RES - 0603]
R12  0Ω  [RES - 0603]
R13  0Ω  [RES - 0603]

### Ports
PB0, PB1

### Nets
+12: J4.2 J5.2
GND: Q1.2 Q2.2 R12.1 R13.1
NetJ4_1: J4.1 Q1.3
NetJ5_1: J5.1 Q2.3
NetQ1_1: Q1.1 R10.2 R12.2
NetQ2_1: Q2.1 R11.2 R13.2
NetR10_1: R10.1 ; port PB1
NetR11_1: R11.1 ; port PB0

### Library data of the parts
J4 J5 = Connectors 1x2 2.54mm: 2 Pin (1x2) 2.54mm Erkek Pin Header THT; ComponentLink1Description: Satın Alma Linki; ComponentLink1URL: https://www.direnc.net/2-pin-1x2-254mm-erkek-pin-header-tht; ComponentLink2Description: Datasheet; ComponentLink2URL: https://pdf.direnc.net/upload/2-pin-1x2-254mm-erkek-pin-header-tht-datasheet.pdf
Q1 Q2 = Mosfet: PJA3404_R1_00001 - MOSFET DIS.5.6A 30V N-CH SOT23 ENHANCEMENT SMT; ComponentLink1Description: Satın Alma Linki; ComponentLink1URL: https://www.ozdisan.com/guc-yari-iletkenleri/mosfetler/mosfet-discrete/PJA3404R100001; ComponentLink2Description: Datasheet; ComponentLink2URL: https://cdn.ozdisan.com/ETicaret_Dosya/462895_6521209.pdf
R10-R13 = Res: SMD Res; ComponentLink1Description: Datasheet; ComponentLink1URL: https://cdn.ozdisan.com/ETicaret_Dosya/570122_9878629.pdf; ComponentLink2Description: Satın Alma Linki; ComponentLink2URL: https://www.ozdisan.com/pasif-komponentler/direncler/smt-smd-direncler/TC0325B3301T5C; ComponentLink3Description: Satın Alma Linki; ComponentLink3URL: https://ozdisan.com/pasif-komponentler/direncler/smt-smd-ve-cip-direncler/0603SAF4701T5E; ComponentLink4Description: Satın Alma Linki; ComponentLink4URL: https://ozdisan.com/pasif-komponentler/direncler/smt-smd-ve-cip-direncler/0805S8F604JT5E; ComponentLink5Description: Satın Alma Linki; ComponentLink5URL: https://ozdisan.com/pasif-komponentler/direncler/smt-smd-ve-cip-direncler/0603SAF1022T5E; ComponentLink6Description: Satın Alma Linki; ComponentLink6URL: https://www.ozdisan.com/pasif-komponentler/direncler/smt-smd-direncler/CQ03SAF0000T5E

## Sheet Buzzer.SchDoc
size A4; SheetNumber: 10; SheetTotal: 11
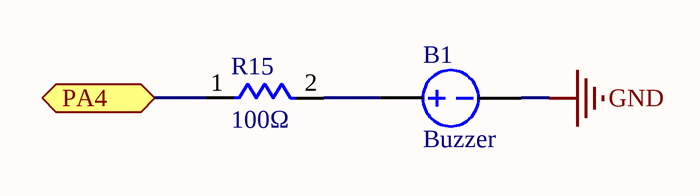
[diagram p9: Buzzer.SchDoc]

### Parts
B1  Buzzer  [Buzzer]
R15  100Ω  [RES - 0603]

### Ports
PA4 (bidir)

### Nets
GND: B1.2
NetB1_1: B1.1 R15.2
NetR15_1: R15.1 ; port PA4

### Library data of the parts
R15 = Res: SMD Res; ComponentLink1Description: Datasheet; ComponentLink1URL: https://cdn.ozdisan.com/ETicaret_Dosya/570122_9878629.pdf; ComponentLink2Description: Satın Alma Linki; ComponentLink2URL: https://www.ozdisan.com/pasif-komponentler/direncler/smt-smd-direncler/TC0325B3301T5C; ComponentLink3Description: Satın Alma Linki; ComponentLink3URL: https://ozdisan.com/pasif-komponentler/direncler/smt-smd-ve-cip-direncler/0603SAF4701T5E; ComponentLink4Description: Satın Alma Linki; ComponentLink4URL: https://ozdisan.com/pasif-komponentler/direncler/smt-smd-ve-cip-direncler/0805S8F604JT5E; ComponentLink5Description: Satın Alma Linki; ComponentLink5URL: https://ozdisan.com/pasif-komponentler/direncler/smt-smd-ve-cip-direncler/0603SAF1022T5E; ComponentLink6Description: Satın Alma Linki; ComponentLink6URL: https://www.ozdisan.com/pasif-komponentler/direncler/smt-smd-direncler/CQ03SAF0000T5E
B1 = Buzzer: ComponentLink1Description: Satın Alma Linki; ComponentLink1URL: https://www.robotistan.com/buzzer; ComponentLink2Description: Datasheet; ComponentLink2URL: *

## Sheet MQ-135.SchDoc
size A4; SheetNumber: 11; SheetTotal: 11
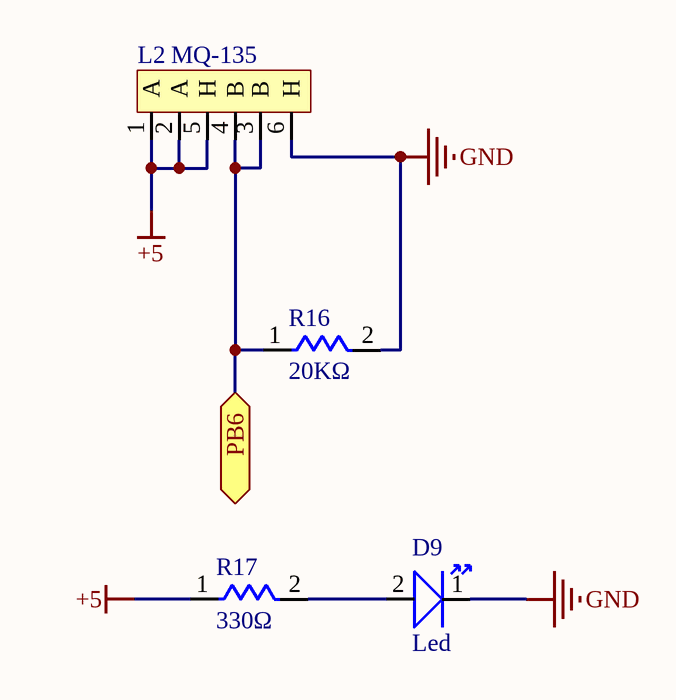
[diagram p10: MQ-135.SchDoc]

### Parts
D9  Led  [LED - 0603]
L2  MQ-135  [MQ-135]
R16  20KΩ  [RES - 0603]
R17  330Ω  [RES - 0603]

### Ports
PB6 (bidir)

### Nets
+5: L2.1(A) L2.2(A) L2.5(H) R17.1
GND: D9.1 L2.6(H) R16.2
NetD9_2: D9.2 R17.2
NetL2_3: L2.3(B) L2.4(B) R16.1 ; port PB6

### Library data of the parts
D9 = Led: as D1 on sheet MCU_Sheet1; ComponentLink1Description: Satın Alma Linki; ComponentLink1URL: https://ozdisan.com/Product/Detail/471660/HL-PST-1608U51GC; ComponentLink2Description: Datasheet; ComponentLink2URL: https://cdn.ozdisan.com/ETicaret_Dosya/471660_7204356.pdf
R16 R17 = Res: SMD Res; ComponentLink1Description: Datasheet; ComponentLink1URL: https://cdn.ozdisan.com/ETicaret_Dosya/570122_9878629.pdf; ComponentLink2Description: Satın Alma Linki; ComponentLink2URL: https://www.ozdisan.com/pasif-komponentler/direncler/smt-smd-direncler/TC0325B3301T5C; ComponentLink3Description: Satın Alma Linki; ComponentLink3URL: https://ozdisan.com/pasif-komponentler/direncler/smt-smd-ve-cip-direncler/0603SAF4701T5E; ComponentLink4Description: Satın Alma Linki; ComponentLink4URL: https://ozdisan.com/pasif-komponentler/direncler/smt-smd-ve-cip-direncler/0805S8F604JT5E; ComponentLink5Description: Satın Alma Linki; ComponentLink5URL: https://ozdisan.com/pasif-komponentler/direncler/smt-smd-ve-cip-direncler/0603SAF1022T5E; ComponentLink6Description: Satın Alma Linki; ComponentLink6URL: https://www.ozdisan.com/pasif-komponentler/direncler/smt-smd-direncler/CQ03SAF0000T5E
L2 = MQ-135: ComponentLink1Description: Satın Alma Linki; ComponentLink1URL: https://www.robotistan.com/hava-kalite-sensoru-mq-135; ComponentLink2Description: Datasheet; ComponentLink2URL: https://www.olimex.com/Products/Components/Sensors/Gas/SNS-MQ135/resources/SNS-MQ135.pdf

## Nets that join several sheets
+3.3V: MCU_Sheet1 (13 pins), SD_CARD_Sheet1 (C9.1 J2.4 R5.2 R6.1), BME_280_Sheet1 (6 pins), MPU_6050_Sheet1 (5 pins), LORA_Sheet1 (R9.1 U6.2), GY_NEO6MV2_Sheet1 (C24.1 R18.1 U7.7 U7.23), AMS_Sheet1 (5 pins)
+5: GY_NEO6MV2_Sheet1 (R14.1), AMS_Sheet1 (C16.1 C18.2 U4.3 Z1.1), LM2596_Sheet1 (C21.1 L1.2 U5.4), MQ-135 (L2.1 L2.2 L2.5 R17.1)
+12: LM2596_Sheet1 (C20.1 J3.1 U5.1), OPEN_DRAIN_Sheet1 (J4.2 J5.2)
GND: MCU_Sheet1 (16 pins), SD_CARD_Sheet1 (7 pins), BME_280_Sheet1 (6 pins), MPU_6050_Sheet1 (9 pins), LORA_Sheet1 (7 pins), GY_NEO6MV2_Sheet1 (10 pins), AMS_Sheet1 (5 pins), LM2596_Sheet1 (7 pins), OPEN_DRAIN_Sheet1 (Q1.2 Q2.2 R12.1 R13.1), Buzzer (B1.2), MQ-135 (D9.1 L2.6 R16.2)
NetJ2_2: MCU_Sheet1 (U1.29), SD_CARD_Sheet1 (J2.2)
NetJ2_3: MCU_Sheet1 (U1.28), SD_CARD_Sheet1 (J2.3)
NetJ2_5: MCU_Sheet1 (U1.26), SD_CARD_Sheet1 (J2.5)
NetJ2_7: MCU_Sheet1 (U1.27), SD_CARD_Sheet1 (J2.7)
NetJ2_9: MCU_Sheet1 (U1.25), SD_CARD_Sheet1 (J2.9 R5.1)
NetL2_3: MCU_Sheet1 (U1.21), MQ-135 (L2.3 L2.4 R16.1)
NetR2_2: MCU_Sheet1 (R2.2 U1.45), BME_280_Sheet1 (U2.3), MPU_6050_Sheet1 (U3.24)
NetR3_2: MCU_Sheet1 (R3.2 U1.46), BME_280_Sheet1 (U2.4), MPU_6050_Sheet1 (U3.23)
NetR10_1: MCU_Sheet1 (U1.19), OPEN_DRAIN_Sheet1 (R10.1)
NetR11_1: MCU_Sheet1 (U1.20), OPEN_DRAIN_Sheet1 (R11.1)
NetR15_1: MCU_Sheet1 (U1.14), Buzzer (R15.1)
NetR19_2: MCU_Sheet1 (U1.42), GY_NEO6MV2_Sheet1 (R19.2)
NetR20_2: MCU_Sheet1 (U1.43), GY_NEO6MV2_Sheet1 (R20.2)
NetU1_30: MCU_Sheet1 (U1.30), LORA_Sheet1 (U6.5)
NetU1_31: MCU_Sheet1 (U1.31), LORA_Sheet1 (U6.4)